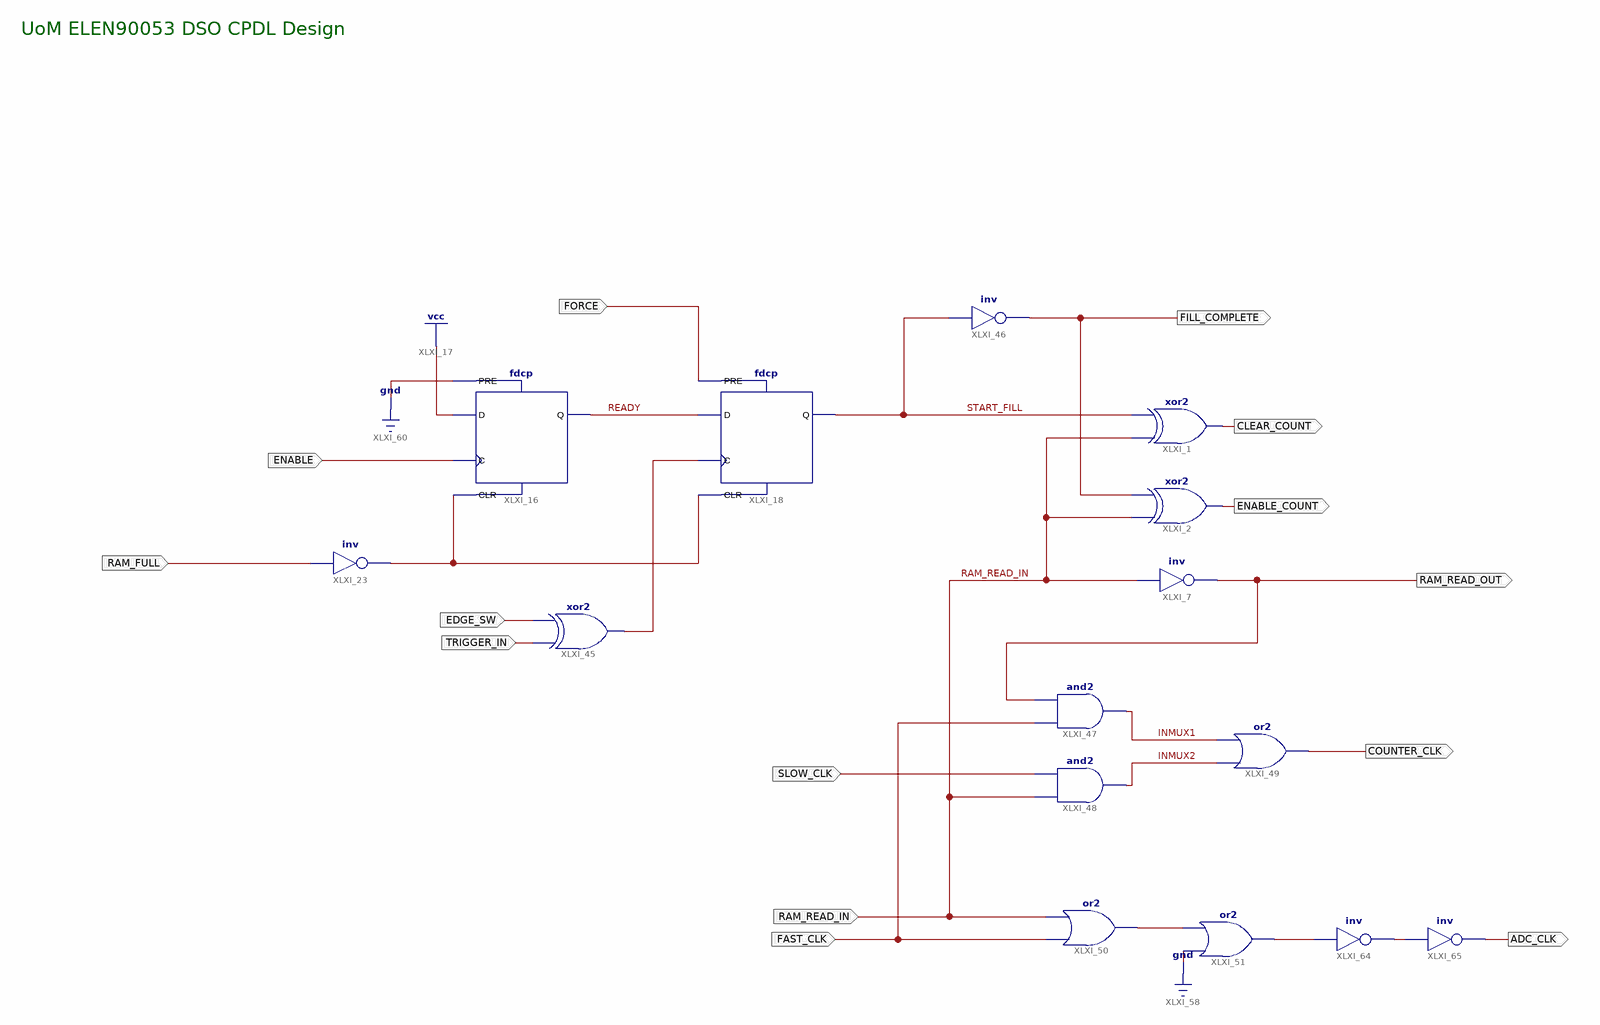
[diagram p0: schematic sheet 1]
// Xilinx ISE schematic CPLD_top.sch (xc9500xl) as structural Verilog: 15 symbols, 14 ports
module CPLD_top (
  input  ENABLE,
  input  RAM_FULL,
  input  SLOW_CLK,
  input  FAST_CLK,
  input  RAM_READ_IN,
  input  FORCE,
  input  EDGE_SW,
  input  TRIGGER_IN,
  output RAM_READ_OUT,
  output CLEAR_COUNT,
  output ENABLE_COUNT,
  output FILL_COMPLETE,
  output COUNTER_CLK,
  output ADC_CLK
);

  wire INMUX1, INMUX2, READY, START_FILL, XLXN_19, XLXN_47, XLXN_52, XLXN_75, XLXN_81;

  fdcp XLXI_18 (.C(XLXN_47), .CLR(XLXN_19), .D(READY), .PRE(FORCE), .Q(START_FILL));
  fdcp XLXI_16 (.C(ENABLE), .CLR(XLXN_19), .D(1'b1), .PRE(1'b0), .Q(READY));
  not XLXI_23 (XLXN_19, RAM_FULL);
  xor XLXI_1 (CLEAR_COUNT, RAM_READ_IN, START_FILL);
  xor XLXI_2 (ENABLE_COUNT, RAM_READ_IN, FILL_COMPLETE);
  not XLXI_7 (RAM_READ_OUT, RAM_READ_IN);
  not XLXI_46 (FILL_COMPLETE, START_FILL);
  and XLXI_47 (INMUX1, FAST_CLK, RAM_READ_OUT);
  and XLXI_48 (INMUX2, RAM_READ_IN, SLOW_CLK);
  or XLXI_49 (COUNTER_CLK, INMUX2, INMUX1);
  or XLXI_51 (XLXN_81, 1'b0, XLXN_52);
  or XLXI_50 (XLXN_52, FAST_CLK, RAM_READ_IN);
  not XLXI_64 (XLXN_75, XLXN_81);
  not XLXI_65 (ADC_CLK, XLXN_75);
  xor XLXI_45 (XLXN_47, TRIGGER_IN, EDGE_SW);

  // Notes on the sheet:
  //   UoM ELEN90053 DSO CPDL Design
endmodule
